# EAGLE design meccano_micro (EAGLE 7.3.0)
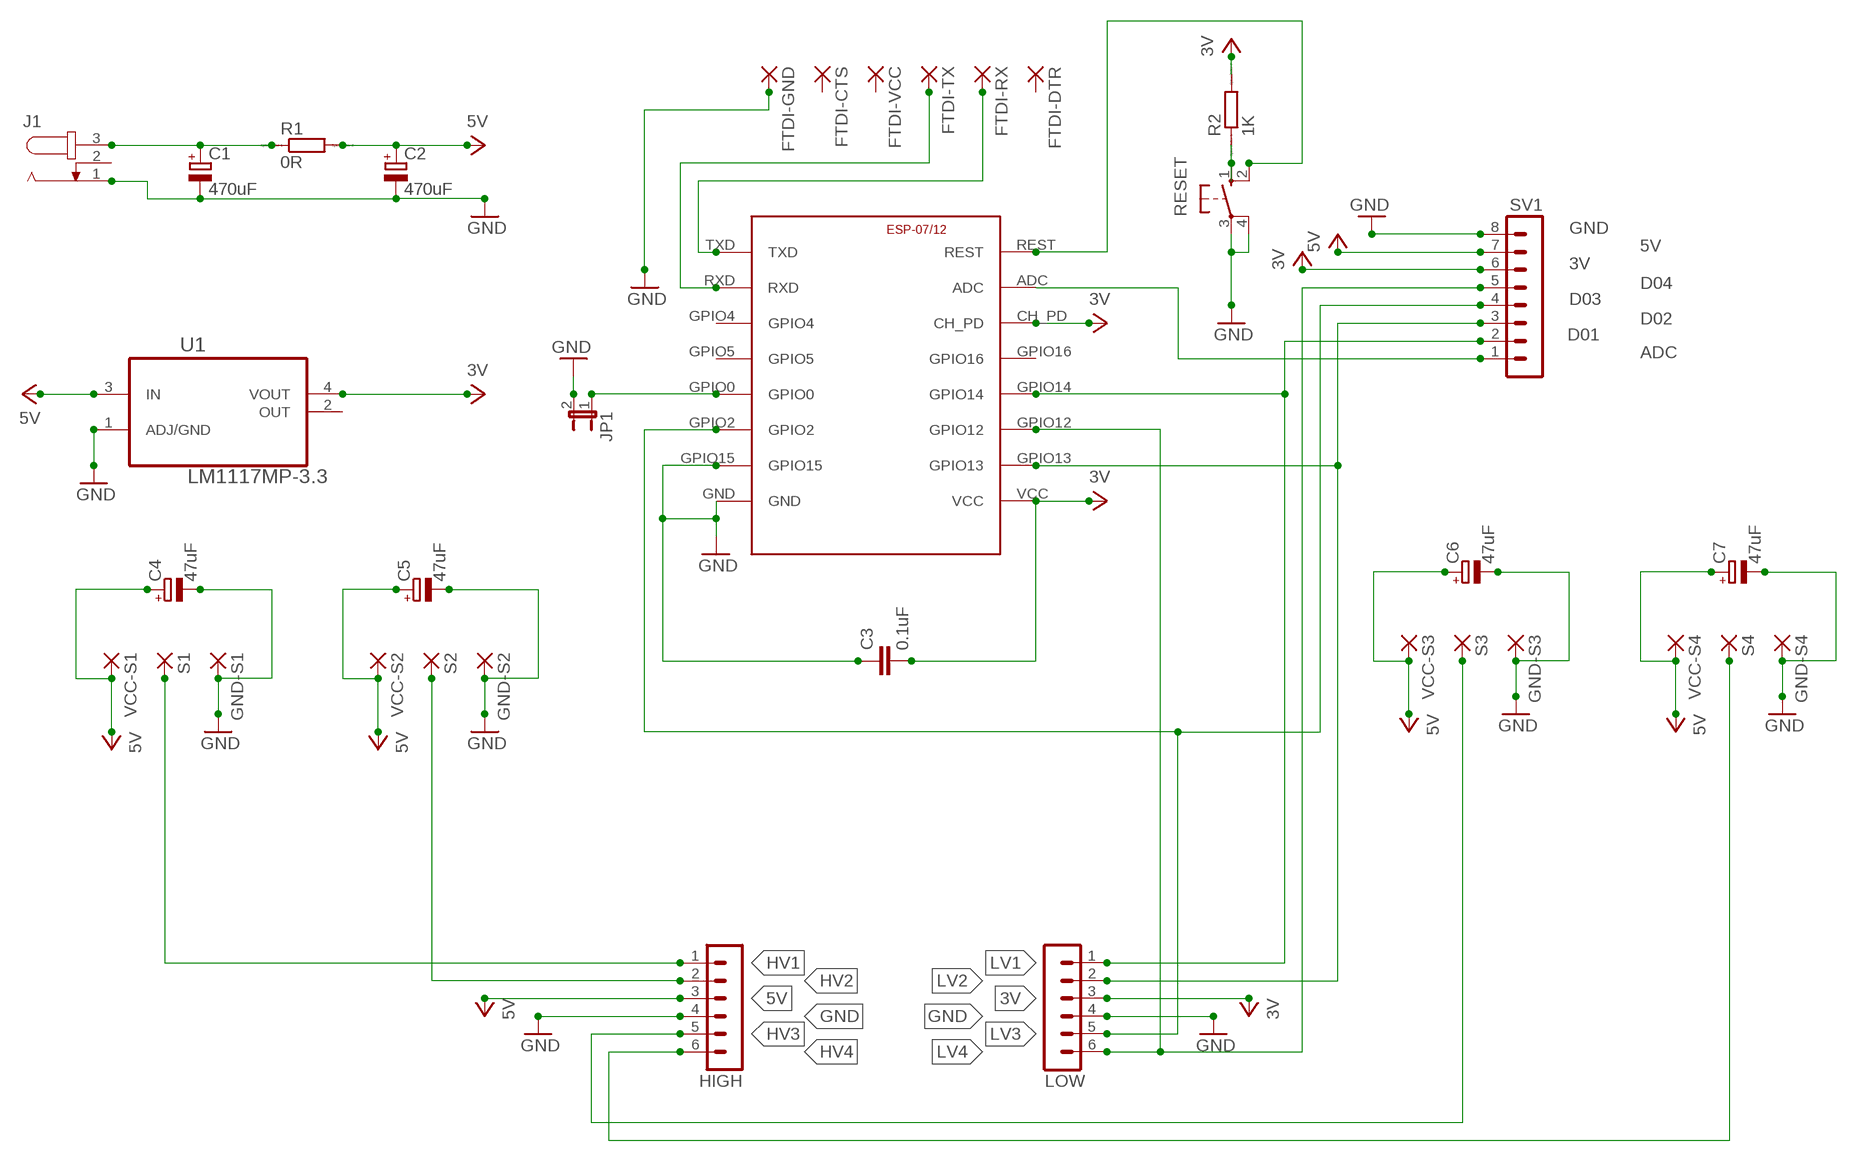
[diagram p0: schematic, sheet 1]

## Parts
C1  470uF  CPOL-EUB45181B  [B45181B]
C2  470uF  CPOL-EUB45181B  [B45181B]
C3  0.1uF  C2.5/4  [C2.5-4]
C4  47uF  CPOL-EUB45181B  [B45181B]
C5  47uF  CPOL-EUB45181B  [B45181B]
C6  47uF  CPOL-EUB45181B  [B45181B]
C7  47uF  CPOL-EUB45181B  [B45181B]
ESP-07/12  ESP8266-07  [ESP-07]
FTDI-CTS  1,6/0,8  [1,6/0,8]
FTDI-DTR  1,6/0,8  [1,6/0,8]
FTDI-GND  1,6/0,8  [1,6/0,8]
FTDI-RX  1,6/0,8  [1,6/0,8]
FTDI-TX  1,6/0,8  [1,6/0,8]
FTDI-VCC  1,6/0,8  [1,6/0,8]
GND-S1  1,6/0,8  [1,6/0,8]
GND-S2  1,6/0,8  [1,6/0,8]
GND-S3  1,6/0,8  [1,6/0,8]
GND-S4  1,6/0,8  [1,6/0,8]
HIGH  MA06-1  [MA06-1]
J1  JACK-PLUG0  [SPC4077]
JP1  JP1E  [JP1]
LOW  MA06-1  [MA06-1]
R1  0R  R0204/7  [0204/7]
R2  1K  R0204/7  [0204/7]
RESET  10-XX  [B3F-10XX]
S1  1,6/0,8  [1,6/0,8]
S2  1,6/0,8  [1,6/0,8]
S3  1,6/0,8  [1,6/0,8]
S4  1,6/0,8  [1,6/0,8]
SV1  MA08-1  [MA08-1]
U1  LM1117MP-3.3  [SOT230P696X180-4N]
VCC-S1  1,6/0,8  [1,6/0,8]
VCC-S2  1,6/0,8  [1,6/0,8]
VCC-S3  1,6/0,8  [1,6/0,8]
VCC-S4  1,6/0,8  [1,6/0,8]

## Nets
3V: C3.2 ESP-07/12.CH_PD ESP-07/12.VCC LOW.3 R2.1 R2.2 RESET.1(S) SV1.6 U1.4(VOUT)
5V: C2.+ C4.+ C5.+ C6.+ C7.+ HIGH.3 R1.2 SV1.7 U1.3(IN) VCC-S1.1(P) VCC-S2.1(P) VCC-S3.1(P) VCC-S4.1(P)
GND: C1.- C2.- C3.1 C4.- C5.- C6.- C7.- ESP-07/12.GND ESP-07/12.GPIO15 FTDI-GND.1(P) GND-S1.1(P) GND-S2.1(P) GND-S3.1(P) GND-S4.1(P) HIGH.4 J1.1 JP1.2 LOW.4 RESET.3(P) RESET.4(P1) SV1.8 U1.1(ADJ/GND)
HV1: HIGH.1 S1.1(P)
HV2: HIGH.2 S2.1(P)
HV3: HIGH.5 S3.1(P)
HV4: HIGH.6 S4.1(P)
LV1: ESP-07/12.GPIO14 LOW.1 SV1.2
LV2: ESP-07/12.GPIO13 LOW.2 SV1.3
LV3: ESP-07/12.GPIO2 LOW.5 SV1.4
LV4: ESP-07/12.GPIO12 LOW.6 SV1.5
N$3: C1.+ J1.3 R1.1
N$4: ESP-07/12.ADC SV1.1
N$6: ESP-07/12.GPIO0 JP1.1
N$7: ESP-07/12.RXD FTDI-TX.1(P)
N$8: ESP-07/12.TXD FTDI-RX.1(P)
N$11: ESP-07/12.REST RESET.2(S1)
Unconnected: ESP-07/12.GPIO4 ESP-07/12.GPIO5 ESP-07/12.GPIO16 FTDI-CTS.1(P) FTDI-DTR.1(P) FTDI-VCC.1(P) J1.2 U1.2(OUT)

## Notes on the sheet
- D04
- D03
- D02
- D01
- ADC

## Library data of the parts
C1 C2 C4-C7 = rcl:CPOL-EU: POLARIZED CAPACITOR, European symbol
C3 = capacitor-wima:C: CAPACITOR naming: grid - package width
ESP-07/12 = lio:ESP8266
FTDI-CTS FTDI-DTR FTDI-GND FTDI-RX FTDI-TX FTDI-VCC GND-S1-GND-S4 S1-S4 VCC-S1-VCC-S4 = wirepad:1,6/0,8: THROUGH-HOLE PAD
HIGH LOW = con-lstb:MA06-1: PIN HEADER; OC_FARNELL: unknown; OC_NEWARK: unknown
J1 = con-jack:JACK-PLUG: DC POWER JACK Power Jack, DC, Right Angle, Through Hole, Rated 5A at 16VDC, PC Terminals Distributor: Farnell (www.Farnell.de) Drawing: 84N1161.pdf / 84N1162.pdf Manufacturer: SPC Technology (www.spctechnology.com) Type: SPC4077 / SPC 4078; OC_FARNELL: unknown; OC_NEWARK: unknown
JP1 = jumper:JP1E: JUMPER
R1 R2 = eagle-ltspice:R: RESISTOR, European symbol; SPICEMODEL: NONE; SPICEPREFIX: R
RESET = switch-omron:10-XX: OMRON SWITCH; MPN: B3F-1000; OC_FARNELL: 176432; OC_NEWARK: 36M3542
SV1 = con-lstb:MA08-1: PIN HEADER; OC_FARNELL: unknown; OC_NEWARK: unknown
U1 = lm1117-smd:LM1117MP-3.3: Linear regulators; MPN: LM1117MP-3.3; OC_FARNELL: 9778195; OC_NEWARK: 41K3470; PACKAGE: SOT223-3; SUPPLIER: NationalSemiconductor

## Net classes
0 default: width 0.5 mm, drill 0.5 mm, clearance 0.5 mm

## Board
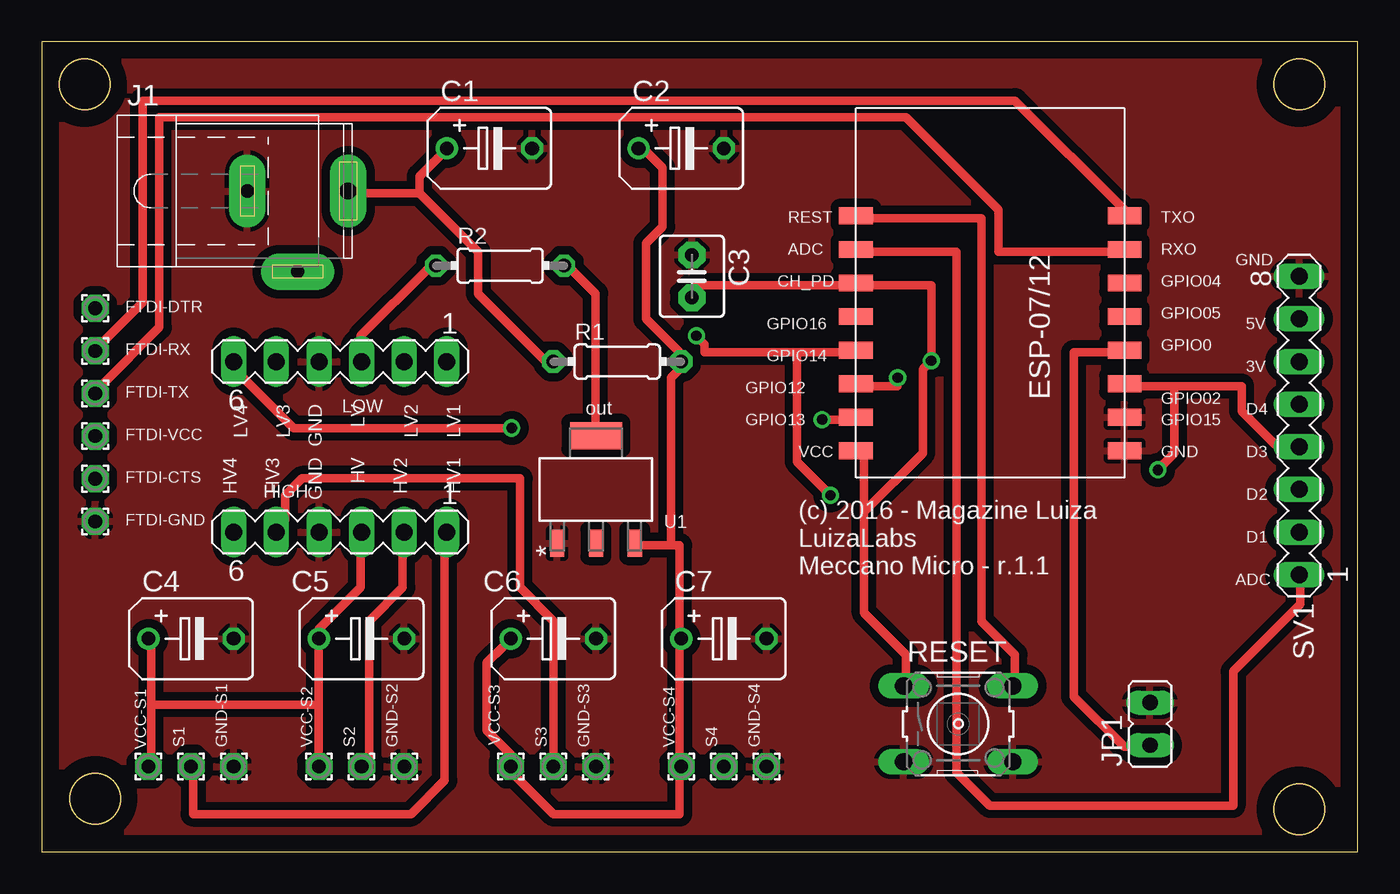
[diagram p1: board, top side]
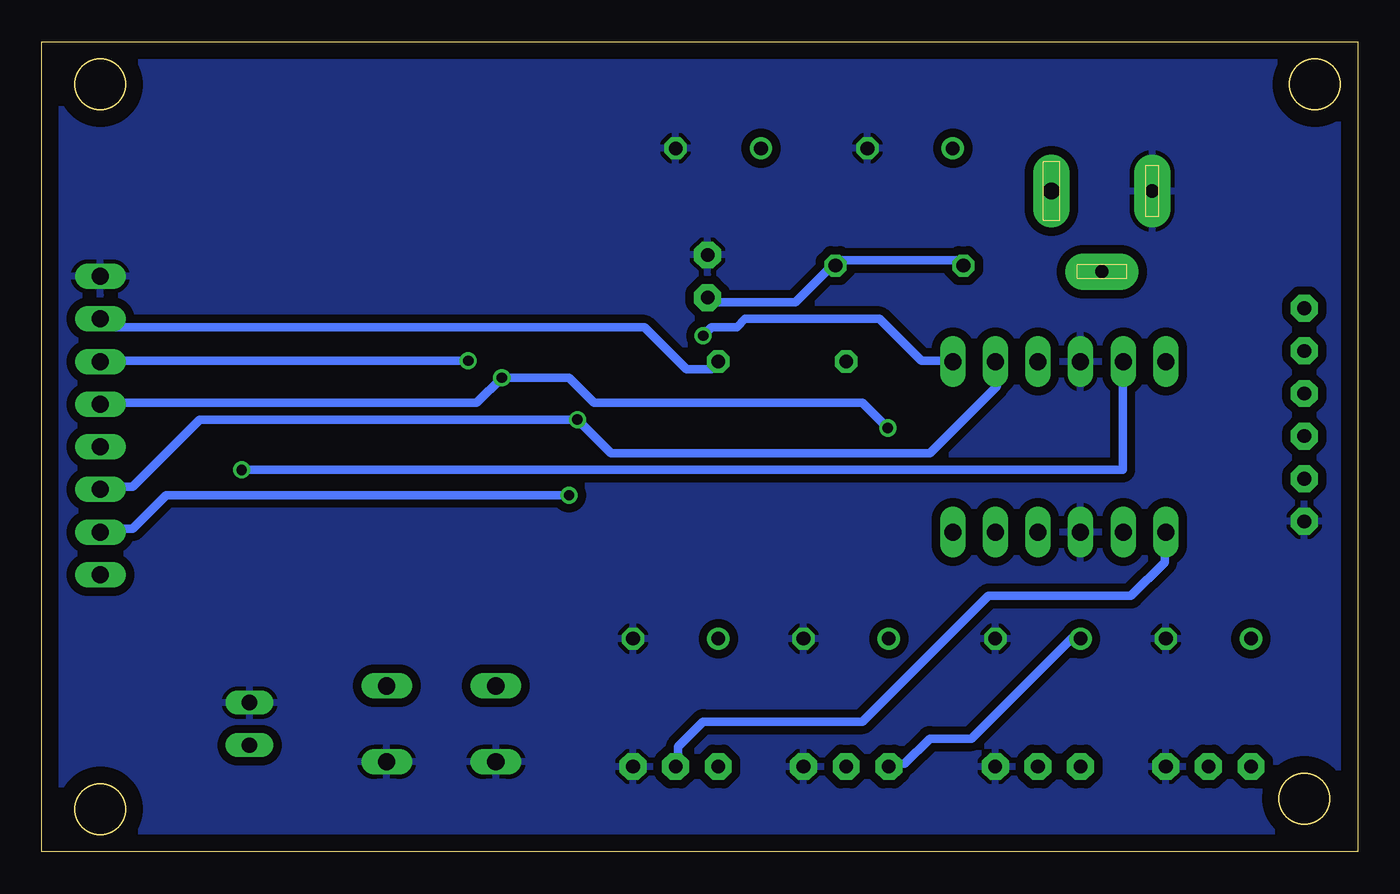
[diagram p2: board, bottom side, seen from below]

Size 78.41 x 48.25 mm. Coordinates in mm from the lower left corner, seen from the top.
Outline: 0,0 78.41,0 78.41,48.25 0,48.25 0,0
Outline: circle at 2.54,45.72 radius 1.5
Outline: circle at 74.93,45.72 radius 1.5
Outline: circle at 74.93,2.54 radius 1.5
Outline: circle at 3.17,3.17 radius 1.5
Copper layers (1*16): Top 0.035mm / dielectric 1.5mm / Bottom 0.035mm
Design rules "default": minimum track width 10mil, minimum drill 24mil, track to track 8mil, track to pad 8mil, pad to pad 8mil, via to via 8mil, smd to smd 8mil, copper to edge 40mil, drill to drill 8mil, minimum pad ring 10mil, minimum via ring 8mil, stop-mask expansion 4mil, vias tented up to drill 0mil, thermal gap 10mil

### Footprints (pad centres in the part's own frame; a part is rotated, then mirrored left to right if it is on the bottom)
B45181B = drill 0.813: + -2.54,0 | drill 0.813 octagon: - 2.54,0
C2.5-4 = drill 0.813 pad 1.6 octagon: 1 -1.27,0; 2 1.27,0
ESP-07 = smd 1 x 2: ADC -1.6,-8; CH_PD 0.4,-8; GND 10.4,8; GPIO0 4.4,8; GPIO2 6.4,8; GPIO4 0.4,8; GPIO5 2.4,8; GPIO12 6.4,-8; GPIO13 8.4,-8; GPIO14 4.4,-8; GPIO15 8.4,8; GPIO16 2.4,-8; REST -3.6,-8; RXD -1.6,8; TXD -3.6,8; VCC 10.4,-8
1,6/0,8 = drill 0.813 pad 1.6 octagon: 1 0,0
MA06-1 = drill 1.016 long: 1 -6.35,0; 2 -3.81,0; 3 -1.27,0; 4 1.27,0; 5 3.81,0; 6 6.35,0
SPC4077 = drill 0.8 pad 2.184 long: 1 -3,0; 2 0,-4.8 | drill 1 pad 2.184 long: 3 3,0
JP1 = drill 0.914 long: 1 0,-1.27; 2 0,1.27
0204/7 = drill 0.813 octagon: 1 -3.81,0; 2 3.81,0
B3F-10XX = drill 1.016 long: 1 -3.251,2.261; 2 3.251,2.261; 3 -3.251,-2.261; 4 3.251,-2.261
MA08-1 = drill 1.016 long: 1 -8.89,0; 2 -6.35,0; 3 -3.81,0; 4 -1.27,0; 5 1.27,0; 6 3.81,0; 7 6.35,0; 8 8.89,0
SOT230P696X180-4N = smd 1.6 x 0.838: 1 -3.2,2.311; 2 -3.2,0; 3 -3.2,-2.311 | smd 1.6 x 3.099: 4 3.2,0

### Placement (x,y rotation side)
C1  26.67,41.91 0 top
C2  38.1,41.91 0 top
C3  38.73,34.29 270 top
C4  8.89,12.7 0 top
C5  19.05,12.7 0 top
C6  30.48,12.7 0 top
C7  40.64,12.7 0 top
ESP-07/12  56.52,34.29 270 top
FTDI-CTS  3.17,22.23 0 top
FTDI-DTR  3.17,32.39 0 top
FTDI-GND  3.17,19.69 0 top
FTDI-RX  3.17,29.84 0 top
FTDI-TX  3.17,27.3 0 top
FTDI-VCC  3.17,24.77 0 top
GND-S1  11.43,5.08 0 top
GND-S2  21.59,5.08 0 top
GND-S3  33.02,5.08 0 top
GND-S4  43.18,5.08 0 top
HIGH  17.78,19.05 180 top
J1  15.24,39.37 0 top
JP1  66.04,7.62 0 top
LOW  17.78,29.21 180 top
R1  34.29,29.21 0 top
R2  27.3,34.92 0 top
RESET  54.61,7.62 0 top
S1  8.89,5.08 180 top
S2  19.05,5.08 0 top
S3  30.48,5.08 0 top
S4  40.64,5.08 0 top
SV1  74.93,25.4 90 top
U1  33.02,21.59 90 top
VCC-S1  6.35,5.08 0 top
VCC-S2  16.51,5.08 0 top
VCC-S3  27.94,5.08 0 top
VCC-S4  38.1,5.08 0 top

### Tracks (layer width: path | path; a pad name or v marks a point on that pad's centre or on a via)
3V  (via drill 0.61)
  Top 0.5: R2.1 23,34.75 19,30.75 19,29.25 LOW.3 | R2.2 31.5,34.75 33,33.25 33,25.25 U1.4 | C3.2 39,33.25 39,33.75 48.5,33.75 ESP-07/12.CH_PD 49,33.75 53,33.75 v53,29.25 52.5,28.75 52.5,23.75 49,20.25 | 49,20.25 49,14.25 51.5,11.75 51.5,10.25 RESET.1 | 49,20.25 49,23.75 ESP-07/12.VCC
  Bottom 0.5: R2.1 23.5,35.25 31,35.25 R2.2 31.5,34.75 33.5,32.75 38.5,32.75 C3.2 | v53,29.25 74.5,29.25 SV1.6
5V
  Top 0.5: 6.5,8.75 6.5,5.25 VCC-S1.1 | 6.5,8.75 6.5,12.25 C4.+ | 16.5,8.75 16.5,5.25 VCC-S2.1 | 16.5,8.75 16.5,12.25 C5.+ 16.5,12.75 16.5,13.25 19,15.75 19,18.75 HIGH.3 | 16.5,8.75 6.5,8.75 | C6.+ 27.5,12.25 26.5,11.25 26.5,7.25 28,5.75 28,5.25 VCC-S3.1 28,4.75 30.5,2.25 38,2.25 38,4.75 VCC-S4.1 38,5.25 38,12.25 C7.+ 38,12.75 38,18.25 37.5,18.25 | 37.5,18.25 35.5,18.25 U1.3 | 37.5,18.25 37.5,28.25 38,28.75 R1.2 38,29.25 38,29.75 36,31.75 36,36.25 37,37.25 37,40.75 36,41.75 C2.+
  Bottom 0.5: SV1.7 74.5,31.75 74,31.25 42.5,31.25 40,28.75 38.5,28.75 R1.2 | C5.+ 17,12.75 23,6.75 25.5,6.75 27,5.25 27.5,5.25 VCC-S3.1
GND
  pour Bottom: 0,48.26 78.74,48.26 78.74,0 0,0
  pour Top: 0,48.26 78.74,48.26 78.74,0 0,0
  pour Bottom: 0,48.26 78.74,48.26 78.74,0 0,0
HV1
  Top 0.5: HIGH.1 24,18.75 24,4.25 22,2.25 9,2.25 9,4.75 S1.1
HV2
  Top 0.5: HIGH.2 21.5,18.75 21.5,15.75 19.5,13.75 19.5,5.25 S2.1
HV3
  Top 0.5: HIGH.5 14,19.25 14.5,19.75 14.5,21.25 15.5,22.25 28.5,22.25 28.5,15.75 30.5,13.75 30.5,5.25 S3.1
HV4
  Bottom 0.5: HIGH.6 11.5,18.75 11.5,17.25 13.5,15.25 22,15.25 29.5,7.75 39,7.75 40.5,6.25 40.5,5.25 S4.1
LV1  (via drill 0.61)
  Top 0.5: 45,29.75 39.5,29.75 39.5,30.25 v39,30.75 | 45,29.75 48.5,29.75 ESP-07/12.GPIO14 | v47,21.25 45,23.25 45,29.75
  Bottom 0.5: v39,30.75 38.5,31.25 37,31.25 36.5,31.75 28.5,31.75 26,29.25 24.5,29.25 LOW.1 | v47,21.25 71,21.25 73,19.25 74.5,19.25 SV1.2
LV2  (via drill 0.61)
  Top 0.5: v46.5,25.75 48.5,25.75 ESP-07/12.GPIO13
  Bottom 0.5: LOW.2 21.5,28.75 21.5,27.75 25.5,23.75 44.5,23.75 v46.5,25.75 69,25.75 73,21.75 74.5,21.75 SV1.3
LV3  (via drill 0.61)
  Top 0.5: 67.5,27.75 71.5,27.75 71.5,26.25 73.5,24.25 74.5,24.25 SV1.4 | 67.5,27.75 65,27.75 ESP-07/12.GPIO2 | v66.5,22.75 67.5,23.75 67.5,27.75
  Bottom 0.5: v66.5,22.75 14,22.75 14,28.75 LOW.5
LV4  (via drill 0.61)
  Top 0.5: v51,28.25 51,27.75 49,27.75 ESP-07/12.GPIO12 | v28,25.25 15,25.25 11.5,28.75 LOW.6
  Bottom 0.5: SV1.5 74.5,26.75 52.5,26.75 v51,28.25 47,28.25 45.5,26.75 29.5,26.75 v28,25.25
N$3
  Top 0.5: 22.5,39.25 26,35.75 26,33.25 30,29.25 R1.1 | 22.5,39.25 18.5,39.25 J1.3 | 22.5,39.25 22.5,40.25 24,41.75 C1.+
N$4
  Top 0.5: ESP-07/12.ADC 49,35.75 54.5,35.75 54.5,4.75 56.5,2.75 71,2.75 71,10.75 75,14.75 75,16.25 SV1.1
N$6
  Top 0.5: ESP-07/12.GPIO0 64.5,29.75 61.5,29.75 61.5,9.25 64.5,6.25 66,6.25 JP1.1
N$7
  Top 0.5: ESP-07/12.RXD 64.5,35.75 57,35.75 57,38.25 51.5,43.75 7,43.75 7,31.25 3.5,27.75 FTDI-TX.1
N$8
  Top 0.5: ESP-07/12.TXD 64.5,38.25 58,44.75 6,44.75 6,32.75 3.5,30.25 FTDI-RX.1
N$11
  Top 0.5: ESP-07/12.REST 49,37.75 56,37.75 56,13.75 58,11.75 58,10.25 RESET.2

### Text on the board
tNames: REST | TXO | ADC | RXO | GND | CH_PD | GPIO04 | GPIO05 | GPIO16 | 5V | GPIO0 | GPIO14 | 3V | GPIO12 | LV4 | LV3 | GND | LV | LV2 | LV1 | out | GPIO02 | D4 | GPIO13 | GPIO15 | HV4 | HV3 | GND | HV | HV2 | HV1 | VCC | GND | D3 | D2 | D1 | (c) 2016 - Magazine Luiza / LuizaLabs / Meccano Micro - r.1.1 | ADC